# EAGLE schematic 64-colorful-pixels (EAGLE 9.1.0)
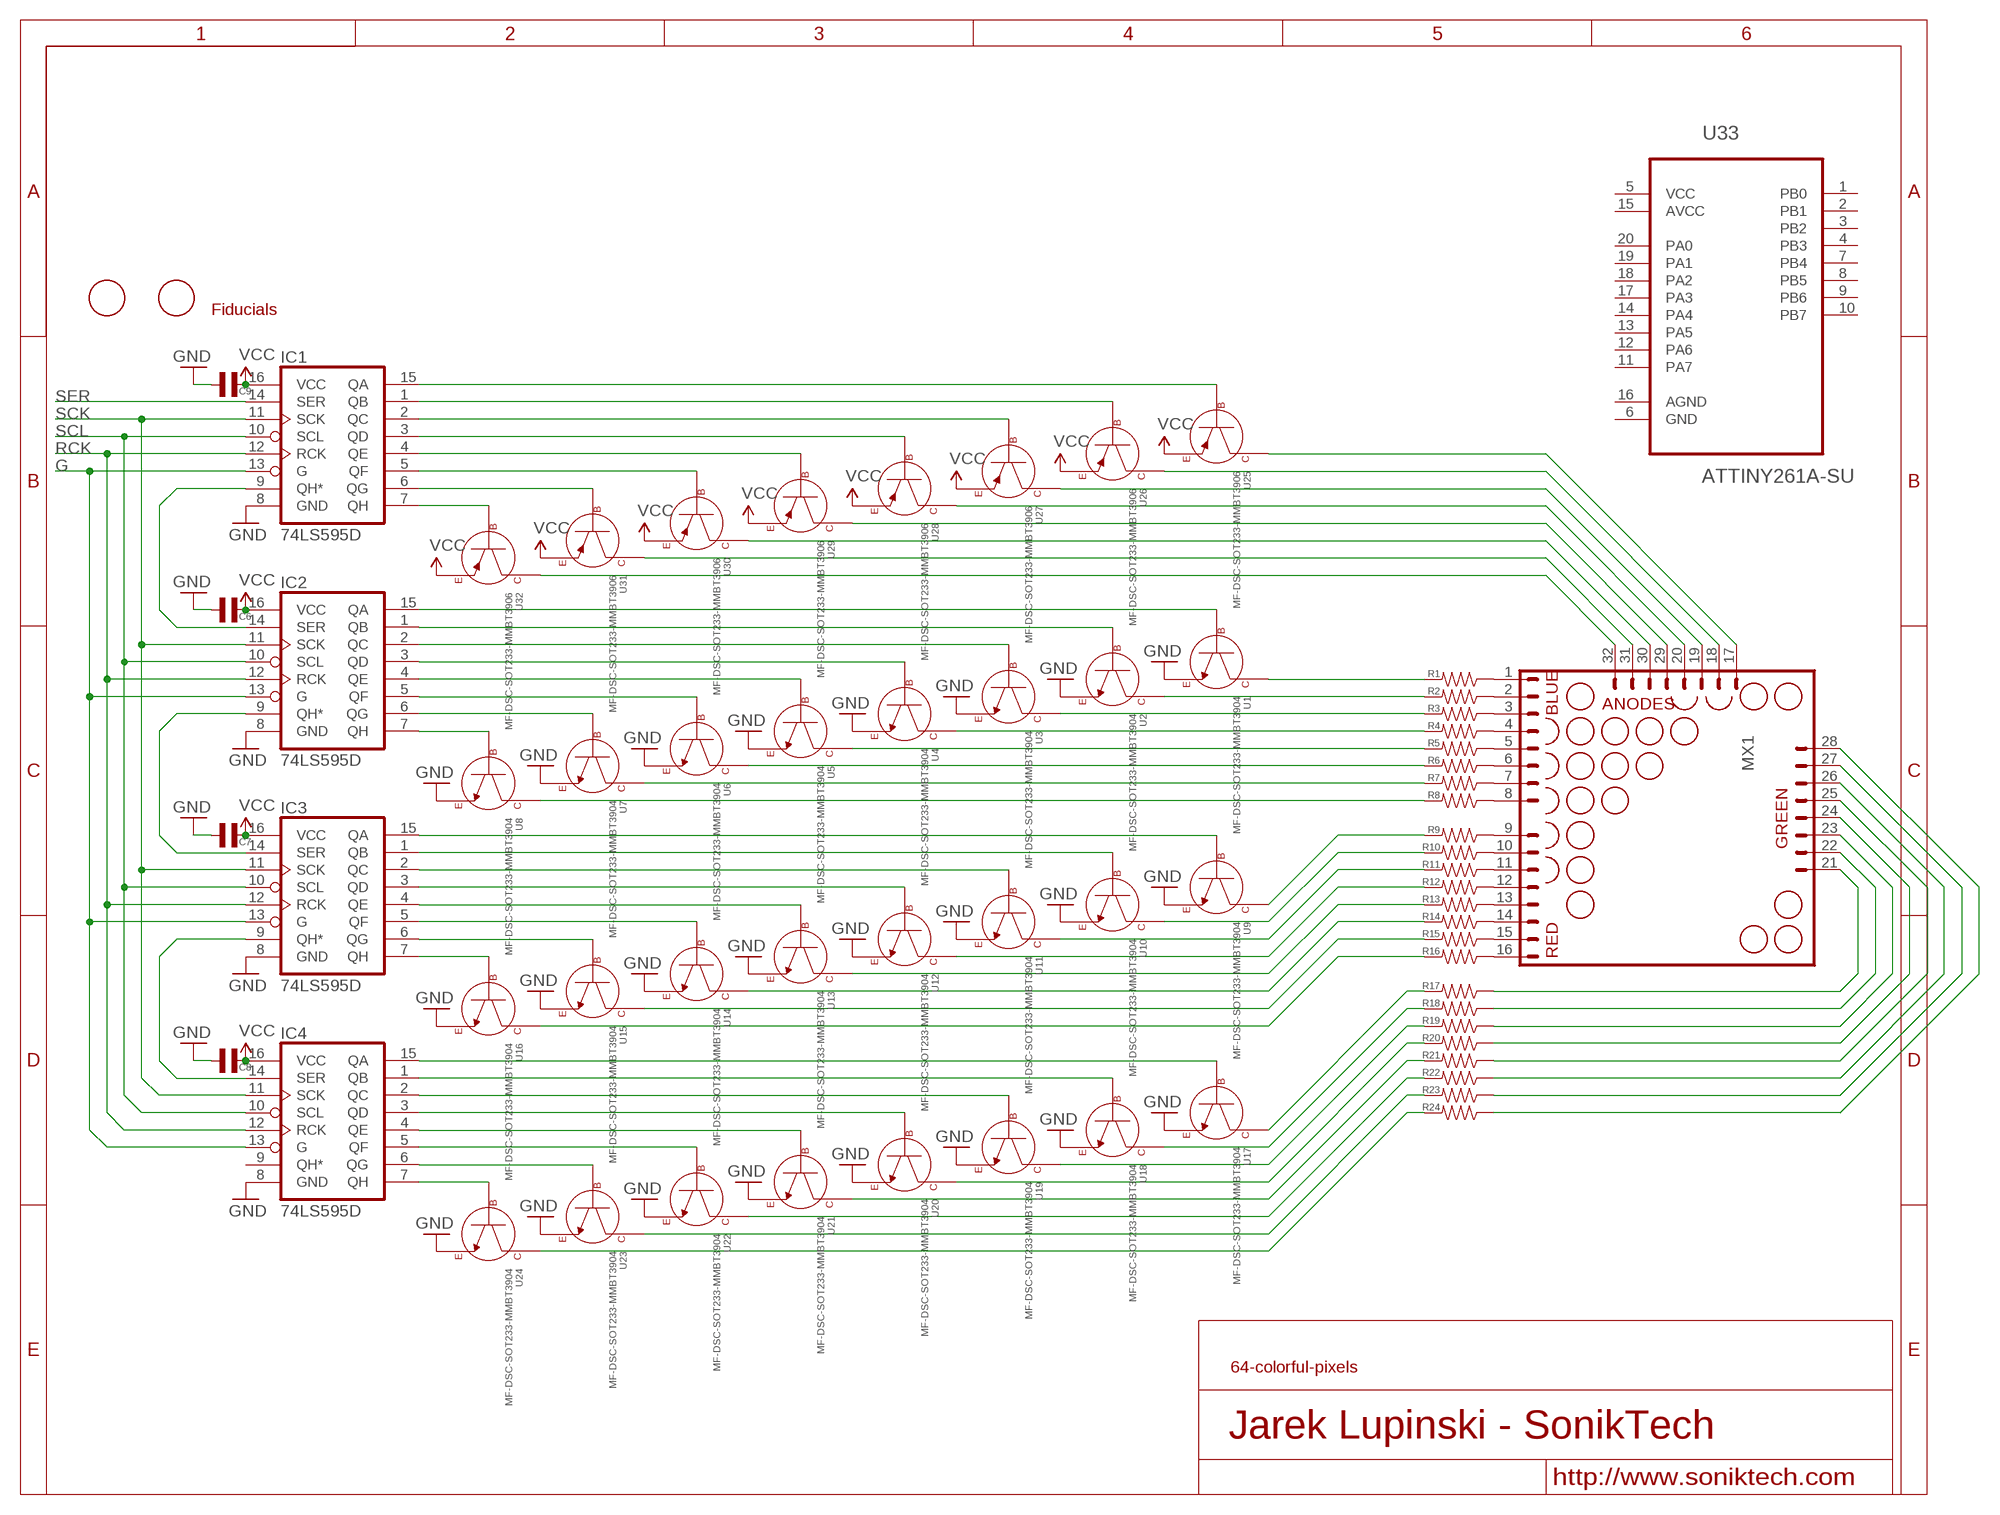
[diagram p0: schematic, sheet 1]

## Parts
C6  CAPACITOR_NP_0402  [C0402]
C7  CAPACITOR_NP_0402  [C0402]
C8  CAPACITOR_NP_0402  [C0402]
C9  CAPACITOR_NP_0402  [C0402]
IC1  74LS595D  [SO16]
IC2  74LS595D  [SO16]
IC3  74LS595D  [SO16]
IC4  74LS595D  [SO16]
MX1  MATRIX_8X8_TRICOLOR_ANODE_ROW  [MATRIX_60MM_32PIN]
Q1  FIDUCIAL  [FIDUCIAL_1MM]
Q2  FIDUCIAL  [FIDUCIAL_1MM]
R1  RESISTOR_0402  [R0402]
R2  RESISTOR_0402  [R0402]
R3  RESISTOR_0402  [R0402]
R4  RESISTOR_0402  [R0402]
R5  RESISTOR_0402  [R0402]
R6  RESISTOR_0402  [R0402]
R7  RESISTOR_0402  [R0402]
R8  RESISTOR_0402  [R0402]
R9  RESISTOR_0402  [R0402]
R10  RESISTOR_0402  [R0402]
R11  RESISTOR_0402  [R0402]
R12  RESISTOR_0402  [R0402]
R13  RESISTOR_0402  [R0402]
R14  RESISTOR_0402  [R0402]
R15  RESISTOR_0402  [R0402]
R16  RESISTOR_0402  [R0402]
R17  RESISTOR_0402  [R0402]
R18  RESISTOR_0402  [R0402]
R19  RESISTOR_0402  [R0402]
R20  RESISTOR_0402  [R0402]
R21  RESISTOR_0402  [R0402]
R22  RESISTOR_0402  [R0402]
R23  RESISTOR_0402  [R0402]
R24  RESISTOR_0402  [R0402]
U1  MF-DSC-SOT233-MMBT3904  NPN_BJTMMBT3904_SOT-23-3  [SOT-23-3]
U2  MF-DSC-SOT233-MMBT3904  NPN_BJTMMBT3904_SOT-23-3  [SOT-23-3]
U3  MF-DSC-SOT233-MMBT3904  NPN_BJTMMBT3904_SOT-23-3  [SOT-23-3]
U4  MF-DSC-SOT233-MMBT3904  NPN_BJTMMBT3904_SOT-23-3  [SOT-23-3]
U5  MF-DSC-SOT233-MMBT3904  NPN_BJTMMBT3904_SOT-23-3  [SOT-23-3]
U6  MF-DSC-SOT233-MMBT3904  NPN_BJTMMBT3904_SOT-23-3  [SOT-23-3]
U7  MF-DSC-SOT233-MMBT3904  NPN_BJTMMBT3904_SOT-23-3  [SOT-23-3]
U8  MF-DSC-SOT233-MMBT3904  NPN_BJTMMBT3904_SOT-23-3  [SOT-23-3]
U9  MF-DSC-SOT233-MMBT3904  NPN_BJTMMBT3904_SOT-23-3  [SOT-23-3]
U10  MF-DSC-SOT233-MMBT3904  NPN_BJTMMBT3904_SOT-23-3  [SOT-23-3]
U11  MF-DSC-SOT233-MMBT3904  NPN_BJTMMBT3904_SOT-23-3  [SOT-23-3]
U12  MF-DSC-SOT233-MMBT3904  NPN_BJTMMBT3904_SOT-23-3  [SOT-23-3]
U13  MF-DSC-SOT233-MMBT3904  NPN_BJTMMBT3904_SOT-23-3  [SOT-23-3]
U14  MF-DSC-SOT233-MMBT3904  NPN_BJTMMBT3904_SOT-23-3  [SOT-23-3]
U15  MF-DSC-SOT233-MMBT3904  NPN_BJTMMBT3904_SOT-23-3  [SOT-23-3]
U16  MF-DSC-SOT233-MMBT3904  NPN_BJTMMBT3904_SOT-23-3  [SOT-23-3]
U17  MF-DSC-SOT233-MMBT3904  NPN_BJTMMBT3904_SOT-23-3  [SOT-23-3]
U18  MF-DSC-SOT233-MMBT3904  NPN_BJTMMBT3904_SOT-23-3  [SOT-23-3]
U19  MF-DSC-SOT233-MMBT3904  NPN_BJTMMBT3904_SOT-23-3  [SOT-23-3]
U20  MF-DSC-SOT233-MMBT3904  NPN_BJTMMBT3904_SOT-23-3  [SOT-23-3]
U21  MF-DSC-SOT233-MMBT3904  NPN_BJTMMBT3904_SOT-23-3  [SOT-23-3]
U22  MF-DSC-SOT233-MMBT3904  NPN_BJTMMBT3904_SOT-23-3  [SOT-23-3]
U23  MF-DSC-SOT233-MMBT3904  NPN_BJTMMBT3904_SOT-23-3  [SOT-23-3]
U24  MF-DSC-SOT233-MMBT3904  NPN_BJTMMBT3904_SOT-23-3  [SOT-23-3]
U25  MF-DSC-SOT233-MMBT3906  PNP_BJT_MMBT3906_SOT-23-3  [SOT-23-3]
U26  MF-DSC-SOT233-MMBT3906  PNP_BJT_MMBT3906_SOT-23-3  [SOT-23-3]
U27  MF-DSC-SOT233-MMBT3906  PNP_BJT_MMBT3906_SOT-23-3  [SOT-23-3]
U28  MF-DSC-SOT233-MMBT3906  PNP_BJT_MMBT3906_SOT-23-3  [SOT-23-3]
U29  MF-DSC-SOT233-MMBT3906  PNP_BJT_MMBT3906_SOT-23-3  [SOT-23-3]
U30  MF-DSC-SOT233-MMBT3906  PNP_BJT_MMBT3906_SOT-23-3  [SOT-23-3]
U31  MF-DSC-SOT233-MMBT3906  PNP_BJT_MMBT3906_SOT-23-3  [SOT-23-3]
U32  MF-DSC-SOT233-MMBT3906  PNP_BJT_MMBT3906_SOT-23-3  [SOT-23-3]
U33  ATTINY261A-SU  [SOIC127P1032X265-20N]

## Nets
G: IC1.13(G) IC2.13(G) IC3.13(G) IC4.13(G)
GND [power]: C6.P$1 C7.P$1 C8.P$1 C9.P$1 IC1.8(GND) IC2.8(GND) IC3.8(GND) IC4.8(GND) U1.P$2(EMITTER) U2.P$2(EMITTER) U3.P$2(EMITTER) U4.P$2(EMITTER) U5.P$2(EMITTER) U6.P$2(EMITTER) U7.P$2(EMITTER) U8.P$2(EMITTER) U9.P$2(EMITTER) U10.P$2(EMITTER) U11.P$2(EMITTER) U12.P$2(EMITTER) U13.P$2(EMITTER) U14.P$2(EMITTER) U15.P$2(EMITTER) U16.P$2(EMITTER) U17.P$2(EMITTER) U18.P$2(EMITTER) U19.P$2(EMITTER) U20.P$2(EMITTER) U21.P$2(EMITTER) U22.P$2(EMITTER) U23.P$2(EMITTER) U24.P$2(EMITTER)
N$1: MX1.17 U25.P$3(COLLECTOR)
N$2: MX1.18 U26.P$3(COLLECTOR)
N$3: MX1.19 U27.P$3(COLLECTOR)
N$4: MX1.1 R1.P$1
N$5: R1.P$2 U1.P$3(COLLECTOR)
N$6: MX1.20 U28.P$3(COLLECTOR)
N$7: MX1.29 U29.P$3(COLLECTOR)
N$8: MX1.2 R2.P$1
N$9: MX1.3 R3.P$1
N$10: MX1.30 U30.P$3(COLLECTOR)
N$11: MX1.4 R4.P$1
N$12: MX1.31 U31.P$3(COLLECTOR)
N$13: MX1.5 R5.P$1
N$14: MX1.6 R6.P$1
N$15: MX1.7 R7.P$1
N$16: MX1.8 R8.P$1
N$17: R2.P$2 U2.P$3(COLLECTOR)
N$18: R3.P$2 U3.P$3(COLLECTOR)
N$19: R4.P$2 U4.P$3(COLLECTOR)
N$20: R5.P$2 U5.P$3(COLLECTOR)
N$21: R6.P$2 U6.P$3(COLLECTOR)
N$22: R7.P$2 U7.P$3(COLLECTOR)
N$23: R8.P$2 U8.P$3(COLLECTOR)
N$24: MX1.21 R17.P$1
N$25: MX1.22 R18.P$1
N$26: MX1.23 R19.P$1
N$27: MX1.24 R20.P$1
N$28: MX1.25 R21.P$1
N$29: MX1.26 R22.P$1
N$30: MX1.27 R23.P$1
N$31: MX1.28 R24.P$1
N$32: MX1.32 U32.P$3(COLLECTOR)
N$33: IC1.15(QA) U25.P$1(BASE)
N$34: IC1.1(QB) U26.P$1(BASE)
N$35: IC1.2(QC) U27.P$1(BASE)
N$36: IC1.3(QD) U28.P$1(BASE)
N$37: IC1.4(QE) U29.P$1(BASE)
N$38: IC1.5(QF) U30.P$1(BASE)
N$39: IC1.6(QG) U31.P$1(BASE)
N$40: IC1.7(QH) U32.P$1(BASE)
N$41: IC2.15(QA) U1.P$1(BASE)
N$42: IC2.1(QB) U2.P$1(BASE)
N$43: IC2.2(QC) U3.P$1(BASE)
N$44: IC2.3(QD) U4.P$1(BASE)
N$45: IC2.4(QE) U5.P$1(BASE)
N$46: IC2.5(QF) U6.P$1(BASE)
N$47: IC2.6(QG) U7.P$1(BASE)
N$48: IC2.7(QH) U8.P$1(BASE)
N$49: IC3.15(QA) U9.P$1(BASE)
N$50: IC3.1(QB) U10.P$1(BASE)
N$51: IC3.2(QC) U11.P$1(BASE)
N$52: IC3.3(QD) U12.P$1(BASE)
N$53: IC3.4(QE) U13.P$1(BASE)
N$54: IC3.5(QF) U14.P$1(BASE)
N$55: IC3.6(QG) U15.P$1(BASE)
N$56: IC3.7(QH) U16.P$1(BASE)
N$57: IC4.15(QA) U17.P$1(BASE)
N$58: IC4.1(QB) U18.P$1(BASE)
N$59: IC4.2(QC) U19.P$1(BASE)
N$60: IC4.3(QD) U20.P$1(BASE)
N$61: IC4.4(QE) U21.P$1(BASE)
N$62: IC4.5(QF) U22.P$1(BASE)
N$63: IC4.6(QG) U23.P$1(BASE)
N$64: IC4.7(QH) U24.P$1(BASE)
N$65: MX1.9 R9.P$1
N$66: MX1.10 R10.P$1
N$67: MX1.11 R11.P$1
N$68: MX1.12 R12.P$1
N$69: MX1.13 R13.P$1
N$70: R9.P$2 U9.P$3(COLLECTOR)
N$71: MX1.14 R14.P$1
N$72: MX1.15 R15.P$1
N$73: MX1.16 R16.P$1
N$74: R10.P$2 U10.P$3(COLLECTOR)
N$75: R11.P$2 U11.P$3(COLLECTOR)
N$76: R12.P$2 U12.P$3(COLLECTOR)
N$77: R13.P$2 U13.P$3(COLLECTOR)
N$78: R14.P$2 U14.P$3(COLLECTOR)
N$79: R15.P$2 U15.P$3(COLLECTOR)
N$80: R16.P$2 U16.P$3(COLLECTOR)
N$81: R17.P$2 U17.P$3(COLLECTOR)
N$82: R18.P$2 U18.P$3(COLLECTOR)
N$83: R19.P$2 U19.P$3(COLLECTOR)
N$84: R20.P$2 U20.P$3(COLLECTOR)
N$85: R21.P$2 U21.P$3(COLLECTOR)
N$86: R22.P$2 U22.P$3(COLLECTOR)
N$87: R23.P$2 U23.P$3(COLLECTOR)
N$88: R24.P$2 U24.P$3(COLLECTOR)
N$89: IC1.9(QH*) IC2.14(SER)
N$90: IC2.9(QH*) IC3.14(SER)
N$91: IC3.9(QH*) IC4.14(SER)
RCK: IC1.12(RCK) IC2.12(RCK) IC3.12(RCK) IC4.12(RCK)
SCK: IC1.11(SCK) IC2.11(SCK) IC3.11(SCK) IC4.11(SCK)
SCL: IC1.10(SCL) IC2.10(SCL) IC3.10(SCL) IC4.10(SCL)
SER: IC1.14(SER)
VCC: C6.P$2 C7.P$2 C8.P$2 C9.P$2 IC1.16(VCC) IC2.16(VCC) IC3.16(VCC) IC4.16(VCC) U25.P$2(EMITTER) U26.P$2(EMITTER) U27.P$2(EMITTER) U28.P$2(EMITTER) U29.P$2(EMITTER) U30.P$2(EMITTER) U31.P$2(EMITTER) U32.P$2(EMITTER)
Unconnected: IC4.9(QH*) U33.1(PB0) U33.2(PB1) U33.3(PB2) U33.4(PB3) U33.6(GND) U33.7(PB4) U33.8(PB5) U33.9(PB6) U33.10(PB7) U33.11(PA7) U33.12(PA6) U33.13(PA5) U33.14(PA4) U33.16(AGND) U33.17(PA3) U33.18(PA2) U33.19(PA1) U33.20(PA0)

## Notes on the sheet
- Fiducials

## Power pins joined to a net without a drawn wire
AVCC: U33.15(AVCC)
VCC: U33.5(VCC)

## Library data of the parts
C6-C9 = MF_Passives:CAPACITOR_NP: Library: MF_Passives Description: Device for Non-Polarized Capacitors. Manufacture part number (MPN) can be added via Attributes. Check https://factory.macrofab.com/parts for the house parts list.; POPULATE: 1
IC1-IC4 = SparkFun-DigitalIC:74*595: 8-bit SHIFT REGISTER, output latch; PROD_ID: IC-07875
MX1 = matrix:MATRIX_8X8_TRICOLOR_ANODE_ROW: RGB 8x8 LED Matrix This variety of display has one anode pin for each row, and three cathode pins for each column. Each anode is shared by red, green and blue cathodes for each cell in the matrix. This part matches the matrix sold by LEDsee.com (SKU: RGBMATRIX) and Seeedstudio.com (SKU: LEDRGBMatrix). The datasheet lists the source as "Guoyexing Optoelectronics Co. Ltd.," part number GYXM-2388AURPGB.
Q1 Q2 = adafruit:FIDUCIAL: For use by pick and place machines to calibrate the vision/machine, 1mm By microbuilder.eu
R1-R24 = MF_Passives:RESISTOR: Library: MF_Passives Description: Device for Resistors. Manufacture part number (MPN), Voltage, Tolerance, and Wattage Rating can be added via Attributes. Check https://factory.macrofab.com/parts for the house parts list.; POPULATE: 1
U1-U24 = MF_Discrete_Semiconductor:NPN_BJT: Library: MF_Discrete_Semiconductor Description: Device for Single NPN BJT Transistors. Manufacture part number (MFG#) can be added via Attributes.; HOUSEPART: YES; MPN: MF-DSC-SOT233-MMBT3904; POPULATE: 1; URL: https://factory.macrofab.com/part/MF-DSC-SOT233-MMBT3904
U25-U32 = MF_Discrete_Semiconductor:PNP_BJT: Library: MF_Discrete_Semiconductor Description: Device for Single PNP BJT Transistors. Manufacture part number (MFG#) can be added via Attributes.; HOUSEPART: YES; MPN: MF-DSC-SOT233-MMBT3906; POPULATE: 1; URL: https://factory.macrofab.com/part/MF-DSC-SOT233-MMBT3906
U33 = element14Atmel:ATTINY261A-SU: 8-bit Microcontroller with In-System Programmable Flash; MPN: ATTINY261A-SU; OC_FARNELL: 1841619; OC_NEWARK: 12T1336; PACKAGE: SOIC-20; SUPPLIER: Atmel